# EAGLE design testador_arduino_r00 (EAGLE 7.5.0)
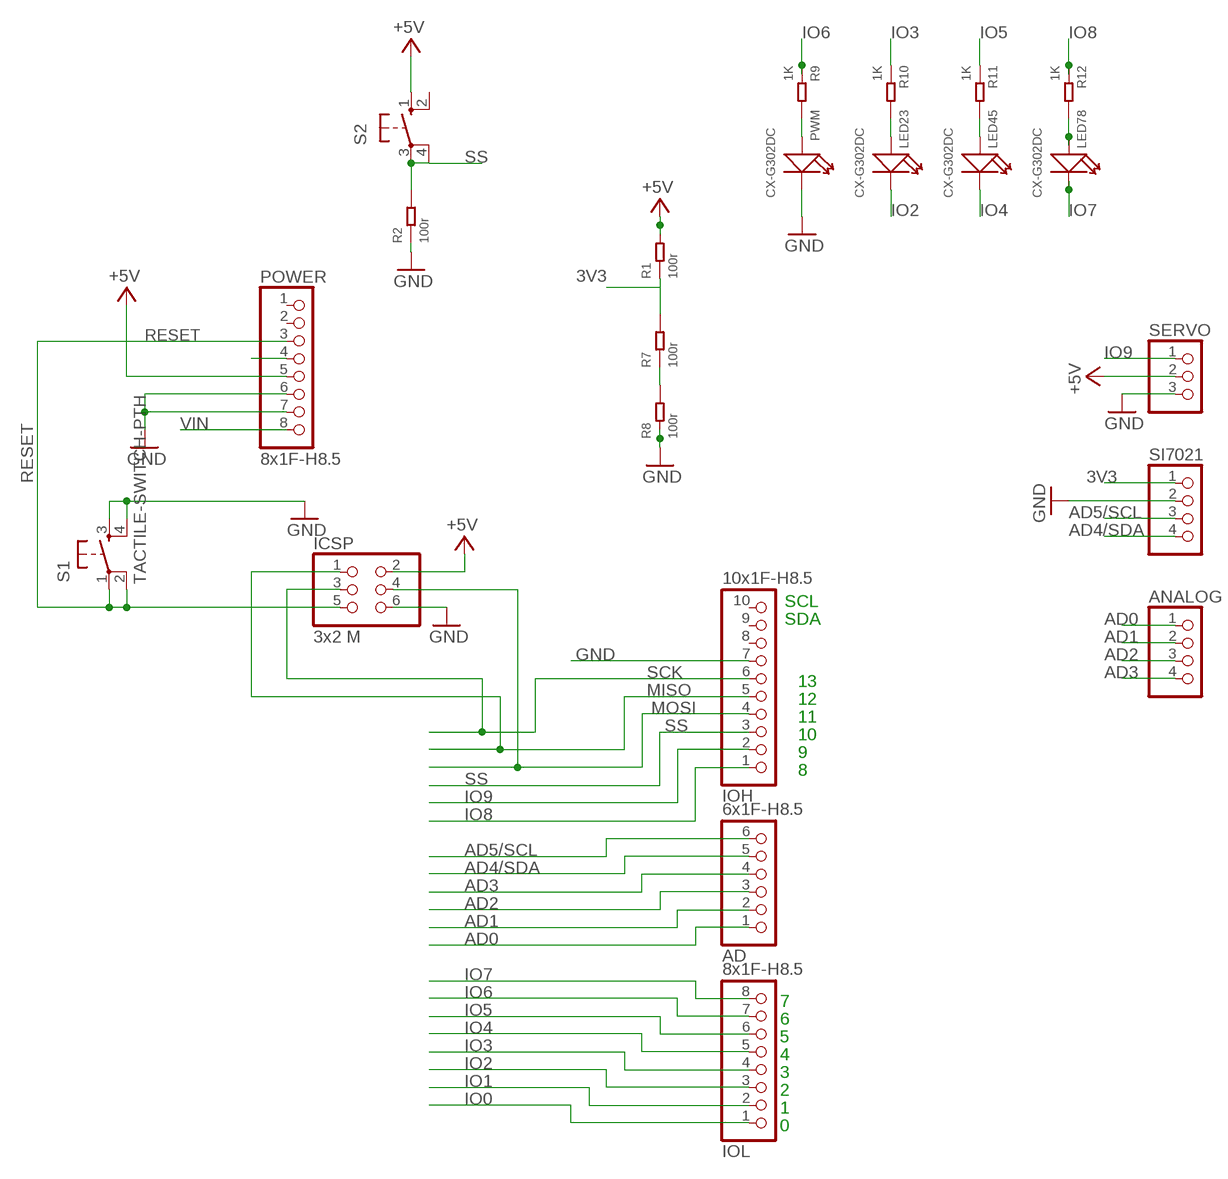
[diagram p0: schematic, sheet 1]

## Parts
AD  6x1F-H8.5  PINHD-1X6  [1X06]
ANALOG  PINHD-1X4  [1X04]
ICSP  3x2 M  PINHD-2X3  [2X03]
IOH  10x1F-H8.5  PINHD-1X10_ARD  [1X10]
IOL  8x1F-H8.5  PINHD-1X8  [1X08]
LED23  CX-G302DC  DIP-LED-GREEN-GREEN(2P-D3MM)  [LED2-2.54-D3.0MM]
LED45  CX-G302DC  DIP-LED-GREEN-GREEN(2P-D3MM)  [LED2-2.54-D3.0MM]
LED78  CX-G302DC  DIP-LED-GREEN-GREEN(2P-D3MM)  [LED2-2.54-D3.0MM]
POWER  8x1F-H8.5  PINHD-1X8  [1X08]
PWM  CX-G302DC  DIP-LED-GREEN-GREEN(2P-D3MM)  [LED2-2.54-D3.0MM]
R1  100r  DIP-RES-1K-5%-1/4W(PR-D2.3XL6.5MM)  [PR-D2.3XL6.5MM]
R2  100r  DIP-RES-1K-5%-1/4W(PR-D2.3XL6.5MM)  [PR-D2.3XL6.5MM]
R7  100r  DIP-RES-1K-5%-1/4W(PR-D2.3XL6.5MM)  [PR-D2.3XL6.5MM]
R8  100r  DIP-RES-1K-5%-1/4W(PR-D2.3XL6.5MM)  [PR-D2.3XL6.5MM]
R9  1K  DIP-RES-1K-5%-1/4W(PR-D2.3XL6.5MM)  [PR-D2.3XL6.5MM]
R10  1K  DIP-RES-1K-5%-1/4W(PR-D2.3XL6.5MM)  [PR-D2.3XL6.5MM]
R11  1K  DIP-RES-1K-5%-1/4W(PR-D2.3XL6.5MM)  [PR-D2.3XL6.5MM]
R12  1K  DIP-RES-1K-5%-1/4W(PR-D2.3XL6.5MM)  [PR-D2.3XL6.5MM]
S1  TACTILE-SWITCH-PTH  [TAC-SWITCH-PTH]
S2  40-XX  [B3F-40XX]
SERVO  PINHD-1X3  [1X03]
SI7021  PINHD-1X4  [1X04]

## Nets
3V3: R1.1 R7.2 SI7021.1
+5V [usbvcc]: ICSP.2 POWER.5 R1.2 S2.1(S) SERVO.2
AD0: AD.1 ANALOG.1
AD1: AD.2 ANALOG.2
AD2: AD.3 ANALOG.3
AD3: AD.4 ANALOG.4
AD4/SDA: AD.5 SI7021.4
AD5/SCL: AD.6 SI7021.3
GND [gnd]: ICSP.6 IOH.7 POWER.6 POWER.7 PWM.K(-) R2.1 R8.1 S1.3 S1.4 SERVO.3 SI7021.2
IO0: IOL.1
IO1: IOL.2
IO2: IOL.3 LED23.K(-)
IO3: IOL.4 R10.1
IO4: IOL.5 LED45.K(-)
IO5: IOL.6 R11.1
IO6: IOL.7 R9.1
IO7: IOL.8 LED78.K(-)
IO8: IOH.1 R12.1
IO9: IOH.2 SERVO.1
MISO: ICSP.1 IOH.5
MOSI: ICSP.4 IOH.4
N$1: POWER.4
N$3: R7.1 R8.2
N$7: PWM.A(+) R9.2
N$8: LED23.A(+) R10.2
N$9: LED45.A(+) R11.2
N$10: LED78.A(+) R12.2
RESET: ICSP.5 POWER.3 S1.1 S1.2
SCK: ICSP.3 IOH.6
SS: IOH.3 R2.2 S2.3(P) S2.4(P1)
VIN [power]: POWER.8
Unconnected: IOH.8 IOH.9 IOH.10 POWER.1 POWER.2 S2.2(S1)

## Notes on the sheet
- SCL
- SDA
- 13
- 12
- 11
- 10
- 9
- 8
- 7
- 6
- 5
- 4
- 3
- 2
- 1
- 0

## Library data of the parts
AD = SmartPrj:PINHD-1X6: PIN HEADER
ANALOG SI7021 = pinhead:PINHD-1X4: PIN HEADER
ICSP = SmartPrj:PINHD-2X3: PIN HEADER
IOH = SmartPrj:PINHD-1X10_ARD: PIN HEADER
IOL POWER = SmartPrj:PINHD-1X8: PIN HEADER
LED23 LED45 LED78 PWM = Seeed-OPL-Diode:DIP-LED-GREEN-GREEN(2P-D3MM): 304090040; MPN: CX-G302DC
R1 R2 R7 R8 = Seeed-OPL-Resistor:DIP-RES-1K-5%-1/4W(PR-D2.3XL6.5MM): 301020000; MPN: FHCFR-1/4W-102J; VALUE: 1K
R9-R12 = Seeed-OPL-Resistor:DIP-RES-1K-5%-1/4W(PR-D2.3XL6.5MM): 301020000; MPN: FHCFR-1/4W-102J
S1 = GeekAmmo:TACTILE-SWITCH: Tactile Switch 4 Pins, SPST NO
S2 = adafruit:40-XX: OMRON SWITCH; MF: OMRON COMPONENTS USA; MPN: B3F-4000; OC_FARNELL: 176434; OC_NEWARK: 36K3105
SERVO = adafruit:PINHD-1X3: PIN HEADER

## Net classes
0 default: width 0.254 mm, clearance 0.254 mm
1 power: width 0.61 mm, drill 0.61 mm, clearance 0.254 mm
2 gnd: width 0.305 mm, drill 0.559 mm, clearance 0.254 mm
3 usbvcc: width 0.508 mm, drill 0.61 mm, clearance 0.254 mm
4 aref: width 0.406 mm, drill 0.61 mm, clearance 0.254 mm

## Board
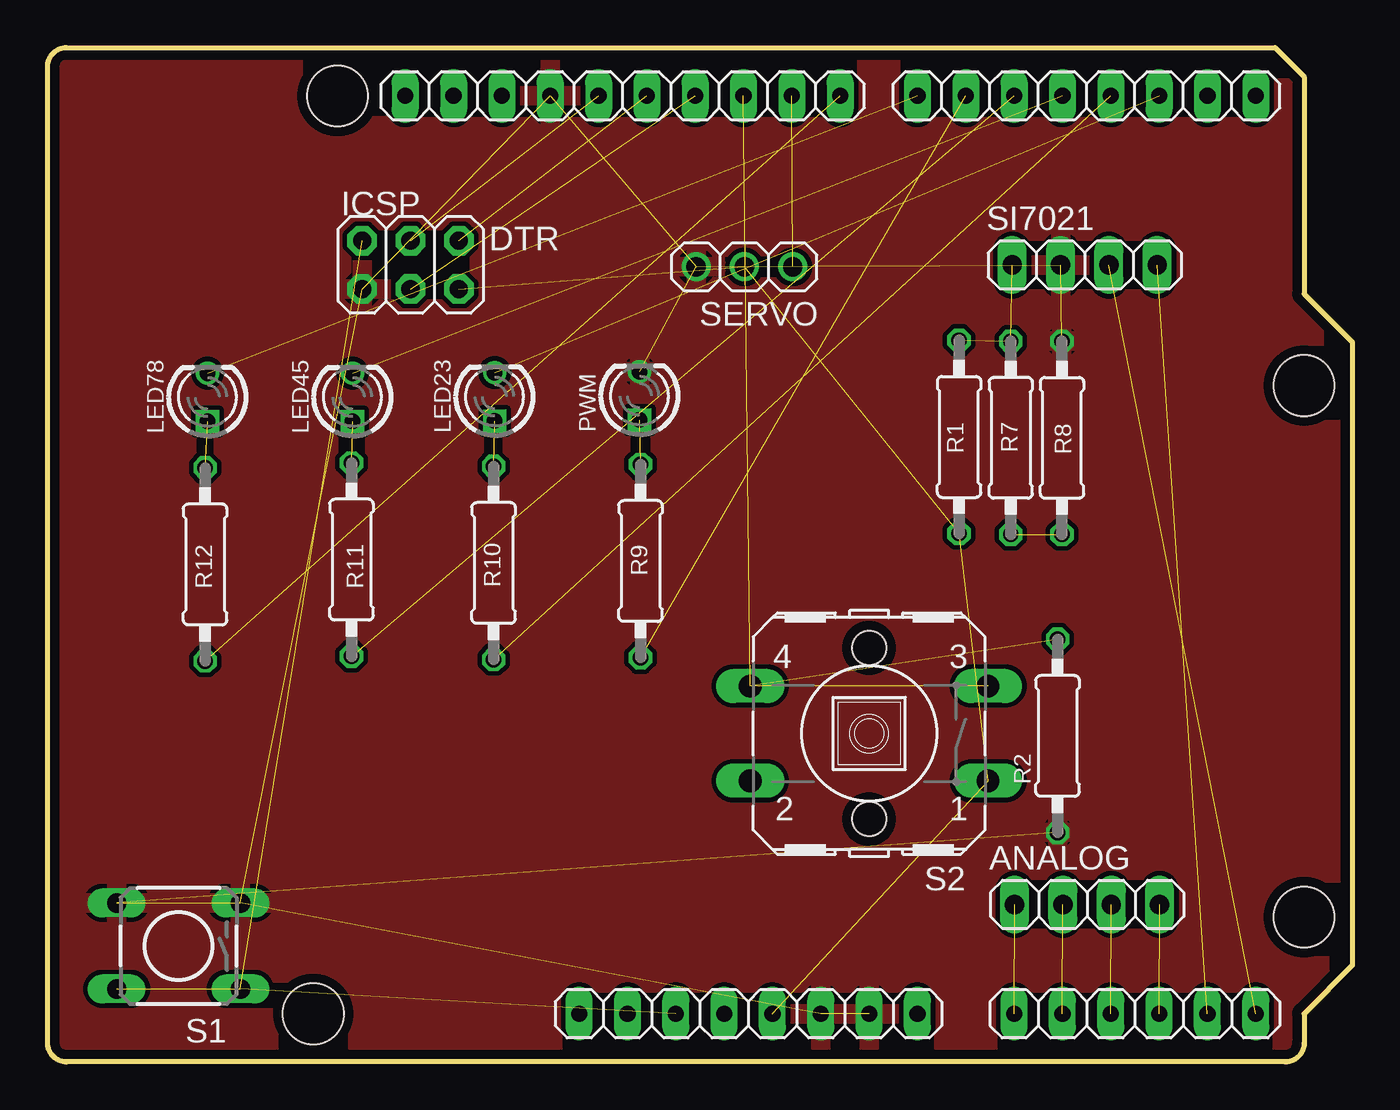
[diagram p1: board, top side]
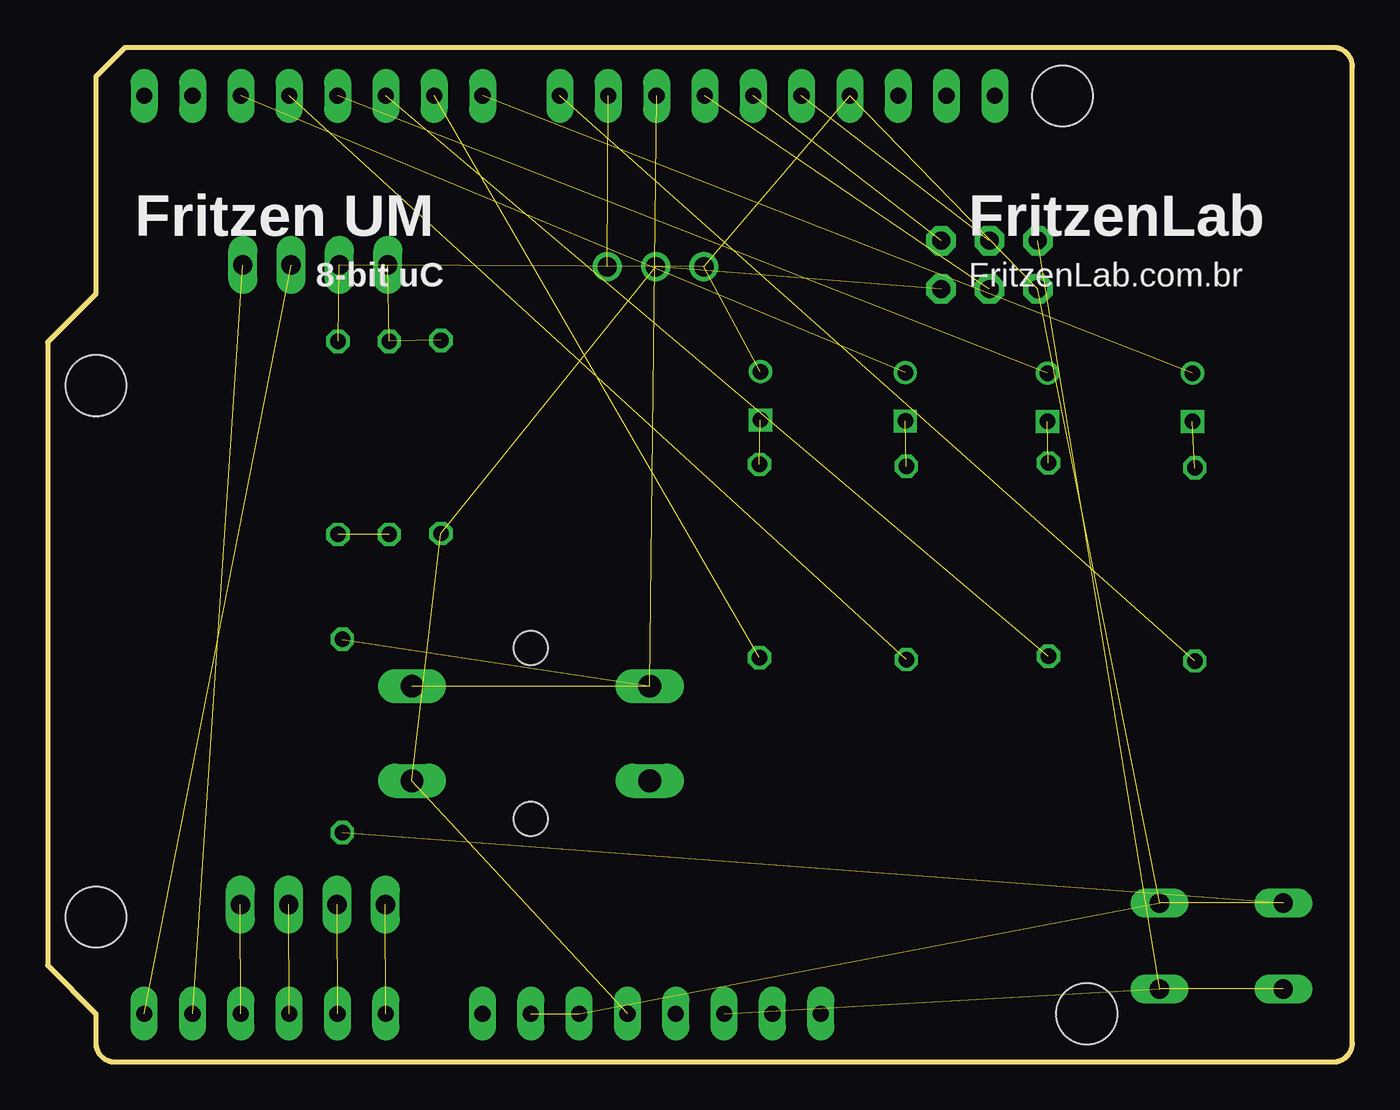
[diagram p2: board, bottom side, seen from below]

Size 68.58 x 53.34 mm. Coordinates in mm from the lower left corner, seen from the top.
Outline: 64.52,53.34 66.04,51.82 66.04,40.39 68.58,37.85 68.58,5.08 66.04,2.54 66.04,1 arc-90 65.04,0 1,0 arc-90 0,1 0,52.34 arc-90 1,53.34 64.52,53.34
Copper layers (1*16): Top 0.035mm / dielectric 1.6mm / Bottom 0.035mm
Design rules "Elecrow_2-layer_PCB_eagle_rule": minimum track width 6mil, minimum drill 12mil, track to track 6mil, track to pad 6mil, pad to pad 6mil, via to via 8mil, smd to smd 0mil, copper to edge 20mil, drill to drill 10mil, minimum pad ring 6mil, minimum via ring 6mil, stop-mask expansion 0mil, vias tented up to drill 100mil, thermal gap 10mil
Holes 3.2 mm at 66.04,35.56 66.04,7.62 15.24,50.8 13.97,2.54

### Footprints (pad centres in the part's own frame; a part is rotated, then mirrored left to right if it is on the bottom)
1X06 = drill 0.85 pad 1.422 long: 1 -6.35,0; 2 -3.81,0; 3 -1.27,0; 4 1.27,0; 5 3.81,0; 6 6.35,0
1X04 = drill 1.016 long: 1 -3.81,0; 2 -1.27,0; 3 1.27,0; 4 3.81,0
2X03 = drill 0.95 pad 1.55 octagon: 1 -2.54,-1.27; 2 -2.54,1.27; 3 0,-1.27; 4 0,1.27; 5 2.54,-1.27; 6 2.54,1.27
1X10 = drill 0.85 pad 1.422 long: 1 -11.43,0; 2 -8.89,0; 3 -6.35,0; 4 -3.81,0; 5 -1.27,0; 6 1.27,0; 7 3.81,0; 8 6.35,0; 9 8.89,0; 10 11.43,0
1X08 = drill 0.85 pad 1.422 long: 1 -8.89,0; 2 -6.35,0; 3 -3.81,0; 4 -1.27,0; 5 1.27,0; 6 3.81,0; 7 6.35,0; 8 8.89,0
LED2-2.54-D3.0MM = drill 0.813 square: A -1.27,0 | drill 0.813: K 1.27,0
PR-D2.3XL6.5MM = drill 0.813 octagon: 1 -4.953,0; 2 5.207,0
TAC-SWITCH-PTH = drill 1.016 pad 1.524 long: 1 -3.251,2.261; 2 3.251,2.261; 3 -3.251,-2.261; 4 3.251,-2.261
B3F-40XX = drill 1.194 long: 1 -6.248,2.489; 2 6.248,2.489; 3 -6.248,-2.489; 4 6.248,-2.489 | hole 1.803: 0,-4.496; 0,4.496
1X03 = drill 1.016: 1 -2.54,0; 2 0,0; 3 2.54,0

### Placement (x,y rotation side)
AD  57.15,2.54 0 top
ANALOG  54.64,8.28 0 top
ICSP  19.08,41.91 180 top
IOH  30.23,50.8 180 top
IOL  54.61,50.8 180 top
LED23  23.5,34.98 90 top
LED45  16.03,34.95 90 top
LED78  8.41,34.95 90 top
POWER  36.83,2.54 0 top
PWM  31.11,35.03 90 top
R1  47.9,32.99 270 top
R2  53.09,17.02 90 top
R7  50.62,32.69 90 top
R8  53.31,32.94 270 top
R9  31.17,26.21 90 top
R10  23.44,26.11 90 top
R11  15.98,26.29 90 top
R12  8.28,26.04 90 top
S1  6.88,6.1 180 top
S2  43.18,17.27 180 top
SERVO  36.63,41.81 180 top
SI7021  54.51,41.91 0 top

### Tracks (layer width: path | path; a pad name or v marks a point on that pad's centre or on a via)
3V3  (2 unrouted)
+5V  (4 unrouted)
AD0  (1 unrouted)
AD1  (1 unrouted)
AD2  (1 unrouted)
AD3  (1 unrouted)
AD4/SDA  (1 unrouted)
AD5/SCL  (1 unrouted)
GND  (10 unrouted)
  pour Top: -1.52,55.63 -1.52,-2.03 71.12,-2.03 71.12,-0.51 70.87,-0.51 70.87,54.61 -1.27,54.61 -1.27,54.36
IO2  (1 unrouted)
IO3  (1 unrouted)
IO4  (1 unrouted)
IO5  (1 unrouted)
IO6  (1 unrouted)
IO7  (1 unrouted)
IO8  (1 unrouted)
IO9  (1 unrouted)
MISO  (1 unrouted)
MOSI  (1 unrouted)
N$3  (1 unrouted)
N$7  (1 unrouted)
N$8  (1 unrouted)
N$9  (1 unrouted)
N$10  (1 unrouted)
RESET  (3 unrouted)
SCK  (1 unrouted)
SS  (3 unrouted)

### Text on the board
tPlace: DTR
bPlace: FritzenLab | Fritzen UM | FritzenLab.com.br | 8-bit uC
214bmp: D:/SmartProjects/Snc/a4_bn_logo2.bmp